# EAGLE schematic source_eagle (EAGLE 9.6.2)

## Sheet 1 of 2
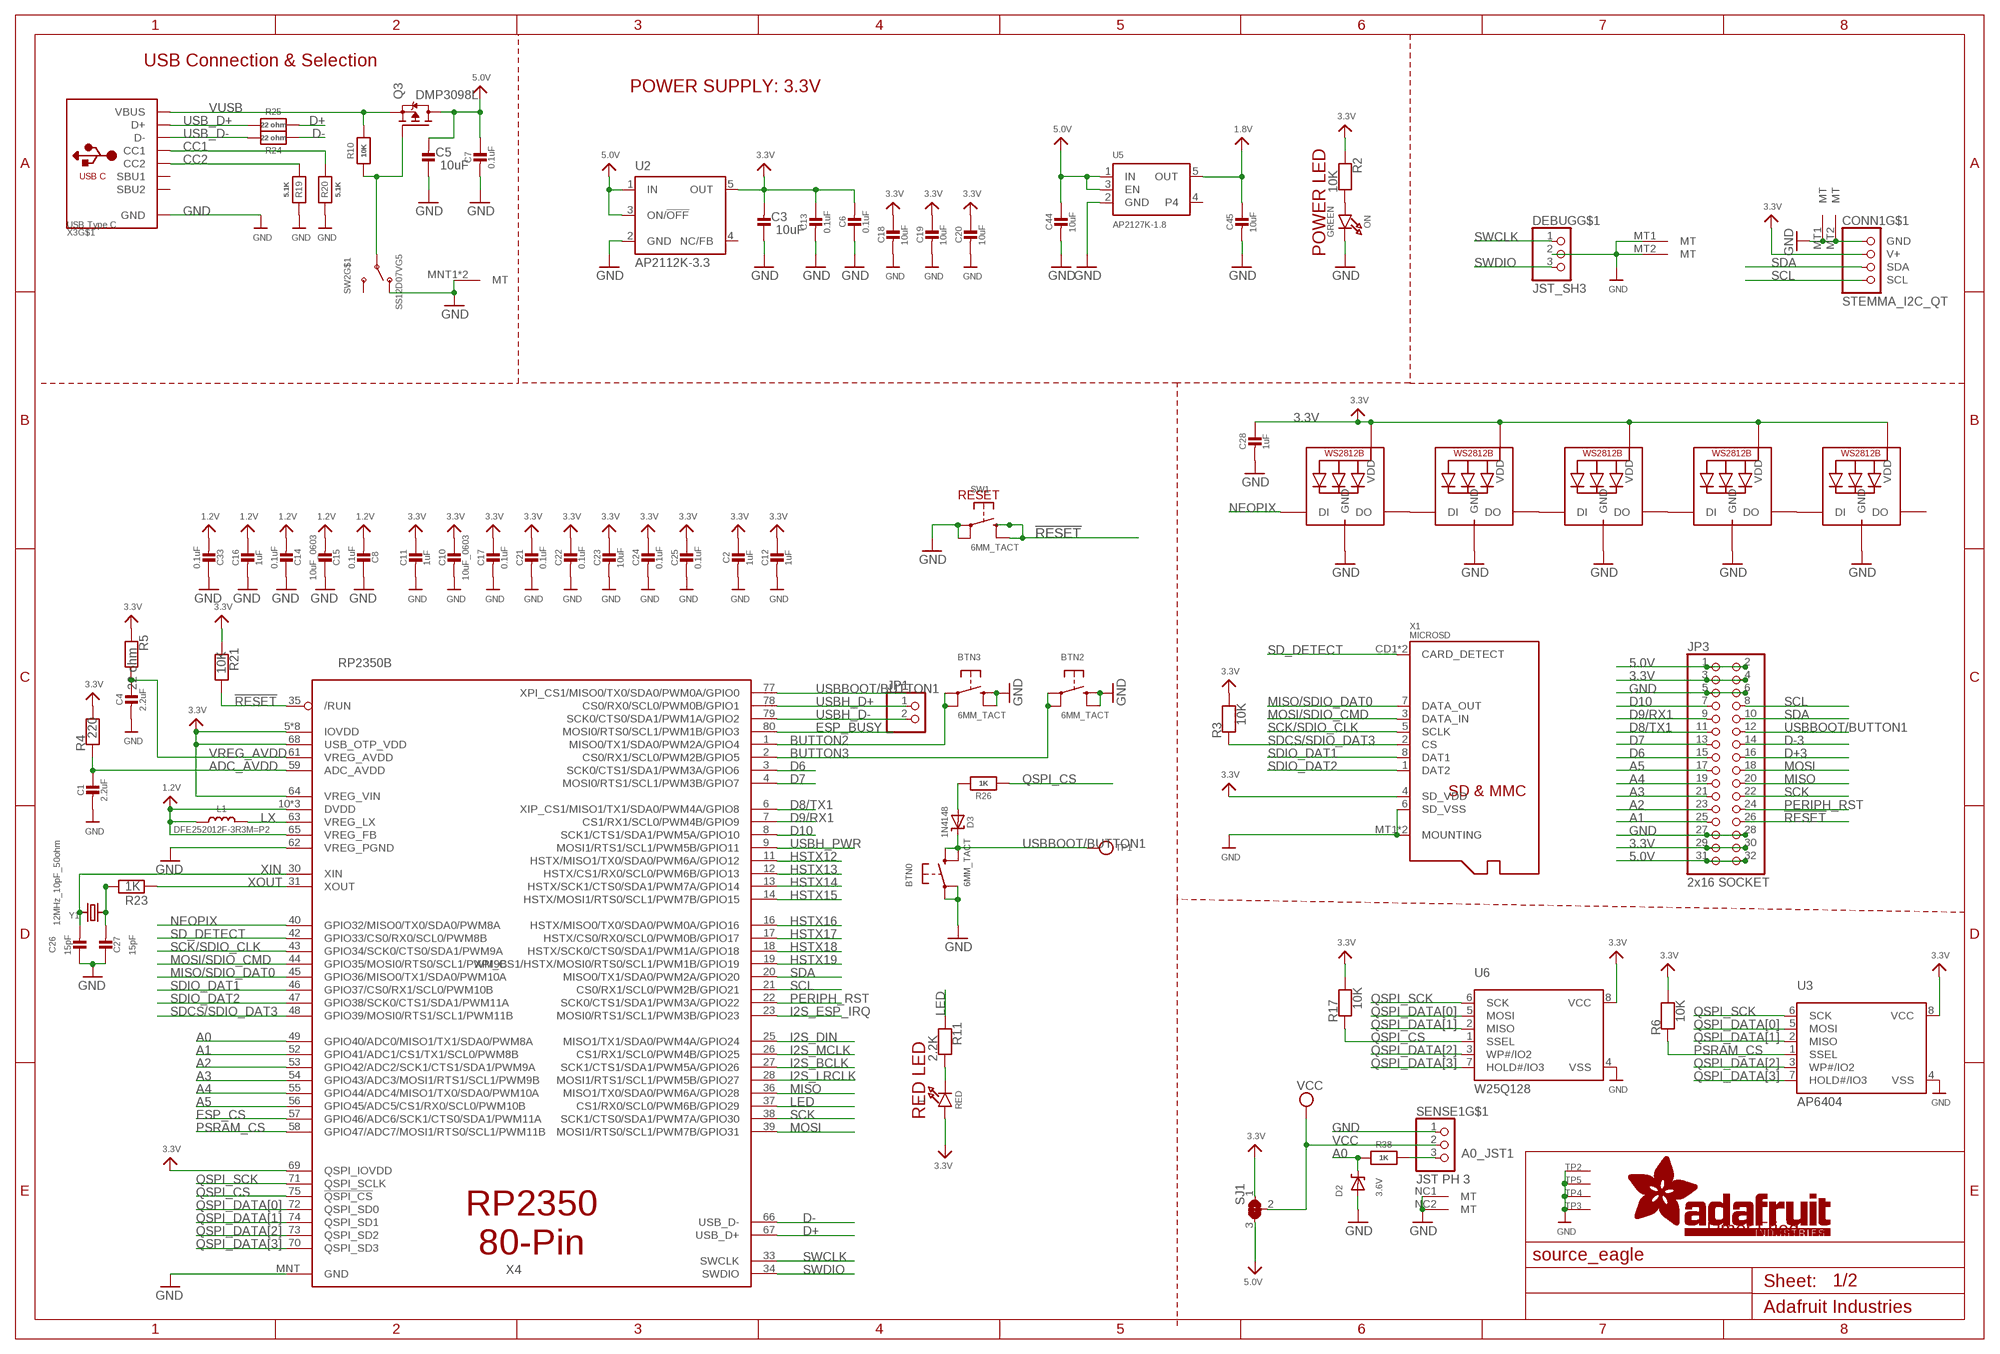
[diagram p0: schematic, sheet 1]

### Parts
BTN0  6MM_TACT  SWITCH_TACT_SMT  [EVQ-Q2]
BTN2  6MM_TACT  SWITCH_TACT_SMT  [EVQ-Q2]
BTN3  6MM_TACT  SWITCH_TACT_SMT  [EVQ-Q2]
C1  2.2uF  CAP_CERAMIC0603_NO  [0603-NO]
C2  1uF  CAP_CERAMIC0603_NO  [0603-NO]
C3  10uF  CAP_CERAMIC0805-NOOUTLINE  [0805-NO]
C4  2.2uF  CAP_CERAMIC0603_NO  [0603-NO]
C5  10uF  CAP_CERAMIC0805-NOOUTLINE  [0805-NO]
C6  0.1uF  CAP_CERAMIC0603_NO  [0603-NO]
C7  0.1uF  CAP_CERAMIC0603_NO  [0603-NO]
C8  0.1uF  CAP_CERAMIC0603_NO  [0603-NO]
C10  10uF_0603  CAP_CERAMIC_0603WIDE  [0603-NO_WIDE]
C11  1uF  CAP_CERAMIC0603_NO  [0603-NO]
C12  1uF  CAP_CERAMIC0603_NO  [0603-NO]
C13  0.1uF  CAP_CERAMIC0603_NO  [0603-NO]
C14  0.1uF  CAP_CERAMIC0603_NO  [0603-NO]
C15  10uF_0603  CAP_CERAMIC_0603WIDE  [0603-NO_WIDE]
C16  1uF  CAP_CERAMIC0603_NO  [0603-NO]
C17  0.1uF  CAP_CERAMIC0603_NO  [0603-NO]
C18  10uF  CAP_CERAMIC0805-NOOUTLINE  [0805-NO]
C19  10uF  CAP_CERAMIC0805-NOOUTLINE  [0805-NO]
C20  10uF  CAP_CERAMIC0805-NOOUTLINE  [0805-NO]
C21  0.1uF  CAP_CERAMIC0603_NO  [0603-NO]
C22  0.1uF  CAP_CERAMIC0603_NO  [0603-NO]
C23  10uF  CAP_CERAMIC0805-NOOUTLINE  [0805-NO]
C24  0.1uF  CAP_CERAMIC0603_NO  [0603-NO]
C25  0.1uF  CAP_CERAMIC0603_NO  [0603-NO]
C26  15pF  CAP_CERAMIC0603_NO  [0603-NO]
C27  15pF  CAP_CERAMIC0603_NO  [0603-NO]
C28  1uF  CAP_CERAMIC0603_NO  [0603-NO]
C33  0.1uF  CAP_CERAMIC0603_NO  [0603-NO]
C44  10uF  CAP_CERAMIC0805-NOOUTLINE  [0805-NO]
C45  10uF  CAP_CERAMIC0805-NOOUTLINE  [0805-NO]
CONN1  STEMMA_I2C_QT  [JST_SH4]
D2  3.6V  DIODE-ZENERSOD323  [SOD-323]
D3  1N4148  DIODE-SCHOTTKYSOD-323  [SOD-323]
DEBUG  JST_SH3  CON_JST_SH_3PINVERT  [JST_SH3_RA]
JP1  HEADER-1X2ROUND  [1X02_ROUND]
JP3  2x16 SOCKET  PINHD-2X16  [2X16]
L  RED  LED0603_NOOUTLINE  [CHIPLED_0603_NOOUTLINE]
L1  DFE252012F-3R3M=P2  INDUCTOR  [INDUCTOR_1007]
LED1  WS2812B_3535FULL  [LED3535_FULLPADS]
LED2  WS2812B_3535FULL  [LED3535_FULLPADS]
LED3  WS2812B_3535FULL  [LED3535_FULLPADS]
LED4  WS2812B_3535FULL  [LED3535_FULLPADS]
LED5  WS2812B_3535FULL  [LED3535_FULLPADS]
ON  GREEN  LED0603_NOOUTLINE  [CHIPLED_0603_NOOUTLINE]
Q3  DMP3098L  MOSFET-PWIDE  [SOT23-WIDE]
R2  10K  RESISTOR_0603_NOOUT  [0603-NO]
R3  10K  RESISTOR_0603_NOOUT  [0603-NO]
R4  220  RESISTOR_0603_NOOUT  [0603-NO]
R5  22 ohm  RESISTOR_0603_NOOUT  [0603-NO]
R6  10K  RESISTOR_0603_NOOUT  [0603-NO]
R10  10K  RESISTOR_0603_NOOUT  [0603-NO]
R11  2.2K  RESISTOR_0603_NOOUT  [0603-NO]
R17  10K  RESISTOR_0603_NOOUT  [0603-NO]
R19  5.1K  RESISTOR_0603_NOOUT  [0603-NO]
R20  5.1K  RESISTOR_0603_NOOUT  [0603-NO]
R21  10K  RESISTOR_0603_NOOUT  [0603-NO]
R23  1K  RESISTOR_0603_NOOUT  [0603-NO]
R24  22 ohm  RESISTOR_0603_NOOUT  [0603-NO]
R25  22 ohm  RESISTOR_0603_NOOUT  [0603-NO]
R26  1K  RESISTOR_0603_NOOUT  [0603-NO]
R38  1K  RESISTOR_0603_NOOUT  [0603-NO]
SENSE1  JST PH 3  CON_JST_PH_3PIN  [JSTPH3]
SJ1  SOLDERJUMPER_2WAY  [SOLDERJUMPER_2WAY_OPEN_NOPASTE]
SW1  6MM_TACT  SWITCH_TACT_SMT  [EVQ-Q2]
SW2  SS12D07VG5  SWITCH_SPDTSS12D07VG5  [SPDT_SS12D07VG5]
TP1  TESTPOINTROUND1.5MMNO  [TESTPOINT_ROUND_1.5MM_NO]
TP2  DNP  SEWTAP_SMTNUTM3  [SMT_NUT_3MM]
TP3  SEWTAP_SMTNUTM3  [SMT_NUT_3MM]
TP4  SEWTAP_SMTNUTM3  [SMT_NUT_3MM]
TP5  SEWTAP_SMTNUTM3  [SMT_NUT_3MM]
U2  AP2112K-3.3  LP2985-XXDBVR33  [SOT23-DBV]
U3  AP6404  SPIFLASH_8PIN208MIL  [SOIC8_208MIL]
U5  AP2127K-1.8  VREG_SOT23-5  [SOT23-5]
U6  W25Q128  SPIFLASH_8PIN208MIL  [SOIC8_208MIL]
X1  MICROSD  [MICROSD]
X3  USB Type C  USB_C  [USB_C_CUSB31-CFM2AX-01-X]
X4  RP2350B  [QFN80]
Y1  12MHz_10pF_50ohm  CRYSTAL2.5X2.0  [CRYSTAL_2.5X2]

### Nets
1.2V: C8.2 C14.2 C15.2 C16.1 C33.2 L1.P$1 X4.10(DVDD) X4.32(DVDD) X4.51(DVDD) X4.65(VREG_FB)
1.8V: C45.1 U5.5(OUT) ; also sheet 2
3.3V [Power]: C2.1 C3.2 C6.2 C10.1 C11.1 C12.1 C13.1 C17.1 C18.1 C19.1 C20.1 C21.1 C22.1 C23.1 C24.1 C25.1 C28.1 CONN1.2(V+) JP3.3 JP3.4 JP3.29 JP3.30 L.A LED1.2(VDD) LED2.2(VDD) LED3.2(VDD) LED4.2(VDD) LED5.2(VDD) R2.1 R3.2 R4.2 R5.1 R6.2 R17.2 R21.1 SJ1.1 U2.5(OUT) U3.8(VCC) U6.8(VCC) X1.4(SD_VDD) X4.5(IOVDD) X4.15(IOVDD) X4.24(IOVDD) X4.29(IOVDD) X4.41(IOVDD) X4.50(IOVDD) X4.60(IOVDD) X4.64(VREG_VIN) X4.68(USB_OTP_VDD) X4.69(QSPI_IOVDD) X4.76(IOVDD) ; also sheet 2
5.0V [Power]: C5.2 C7.1 C44.1 JP3.1 JP3.2 JP3.31 JP3.32 Q3.3(D) SJ1.3 U2.1(IN) U2.3(ON/!OFF) U5.1(IN) U5.3(EN) ; also sheet 2
!RESET: JP3.26 R21.2 SW1.B'(S1) SW1.B(S) X4.35(/RUN)
A0: D2.C R38.2 X4.49(GPIO40/ADC0/MISO1/TX1/SDA0/PWM8A)
A0_JST1: R38.1 SENSE1.3
A1: JP3.25 X4.52(GPIO41/ADC1/CS1/TX1/SCL0/PWM8B)
A2: JP3.23 X4.53(GPIO42/ADC2/SCK1/CTS1/SDA1/PWM9A)
A3: JP3.21 X4.54(GPIO43/ADC3/MOSI1/RTS1/SCL1/PWM9B)
A4: JP3.19 X4.55(GPIO44/ADC4/MISO1/TX0/SDA0/PWM10A)
A5: JP3.17 X4.56(GPIO45/ADC5/CS1/RX0/SCL0/PWM10B)
ADC_AVDD: C1.1 R4.1 X4.59(ADC_AVDD)
BUTTON2: BTN3.A'(P1) BTN3.A(P) X4.1(MISO0/TX1/SDA0/PWM2A/GPIO4)
BUTTON3: BTN2.A'(P1) BTN2.A(P) X4.2(CS0/RX1/SCL0/PWM2B/GPIO5)
CC1: R20.2 X3.A5(CC1)
CC2: R19.2 X3.B5(CC2)
D6: JP3.15 X4.3(SCK0/CTS1/SDA1/PWM3A/GPIO6)
D7: JP3.13 X4.4(MOSI0/RTS1/SCL1/PWM3B/GPIO7)
D8/TX1: JP3.11 X4.6(XIP_CS1/MISO1/TX1/SDA0/PWM4A/GPIO8) ; also sheet 2
D9/RX1: JP3.9 X4.7(CS1/RX1/SCL0/PWM4B/GPIO9) ; also sheet 2
D10: JP3.7 X4.8(SCK1/CTS1/SDA1/PWM5A/GPIO10)
D+: R25.2 X4.67(USB_D+)
D+3: JP3.16 ; also sheet 2
D-: R24.2 X4.66(USB_D-)
D-3: JP3.14 ; also sheet 2
ESP_BUSY: X4.80(MOSI0/RTS0/SCL1/PWM1B/GPIO3) ; also sheet 2
ESP_CS: X4.57(GPIO46/ADC6/SCK1/CTS0/SDA1/PWM11A) ; also sheet 2
GND [Power]: BTN0.A'(P1) BTN0.A(P) BTN2.B'(S1) BTN2.B(S) BTN3.B'(S1) BTN3.B(S) C1.2 C2.2 C3.1 C4.2 C5.1 C6.1 C7.2 C8.1 C10.2 C11.2 C12.2 C13.2 C14.1 C15.1 C16.2 C17.2 C18.2 C19.2 C20.2 C21.2 C22.2 C23.2 C24.2 C25.2 C26.1 C27.1 C28.2 C33.1 C44.2 C45.2 CONN1.1(GND) CONN1.MT1(MT) CONN1.MT2(MT) D2.A DEBUG.2 DEBUG.MT1(MT) DEBUG.MT2(MT) JP3.5 JP3.6 JP3.27 JP3.28 LED1.4(GND) LED2.4(GND) LED3.4(GND) LED4.4(GND) LED5.4(GND) ON.C R19.1 R20.1 SENSE1.1 SENSE1.NC1(MT) SENSE1.NC2(MT) SW1.A'(P1) SW1.A(P) SW2.MNT1(MT) SW2.MNT2(MT) SW2.T1(O) TP2.P$1(SEW) TP3.P$1(SEW) TP4.P$1(SEW) TP5.P$1(SEW) U2.2(GND) U3.4(VSS) U5.2(GND) U6.4(VSS) X1.6(SD_VSS) X1.MT1(MOUNTING) X1.MT2(MOUNTING) X3.A1B12(GND) X3.B1A12(GND) X4.62(VREG_PGND) X4.MNT(GND) ; also sheet 2
HSTX12: X4.11(HSTX/MISO1/TX0/SDA0/PWM6A/GPIO12) ; also sheet 2
HSTX13: X4.12(HSTX/CS1/RX0/SCL0/PWM6B/GPIO13) ; also sheet 2
HSTX14: X4.13(HSTX/SCK1/CTS0/SDA1/PWM7A/GPIO14) ; also sheet 2
HSTX15: X4.14(HSTX/MOSI1/RTS0/SCL1/PWM7B/GPIO15) ; also sheet 2
HSTX16: X4.16(HSTX/MISO0/TX0/SDA0/PWM0A/GPIO16) ; also sheet 2
HSTX17: X4.17(HSTX/CS0/RX0/SCL0/PWM0B/GPIO17) ; also sheet 2
HSTX18: X4.18(HSTX/SCK0/CTS0/SDA1/PWM1A/GPIO18) ; also sheet 2
HSTX19: X4.19(XPI_CS1/HSTX/MOSI0/RTS0/SCL1/PWM1B/GPIO19) ; also sheet 2
I2S_BCLK: X4.27(SCK1/CTS1/SDA1/PWM5A/GPIO26) ; also sheet 2
I2S_DIN: X4.25(MISO1/TX1/SDA0/PWM4A/GPIO24) ; also sheet 2
I2S_ESP_IRQ: X4.23(MOSI0/RTS1/SCL1/PWM3B/GPIO23) ; also sheet 2
I2S_LRCLK: X4.28(MOSI1/RTS1/SCL1/PWM5B/GPIO27) ; also sheet 2
I2S_MCLK: X4.26(CS1/RX1/SCL0/PWM4B/GPIO25) ; also sheet 2
LED: R11.1 X4.37(CS1/RX0/SCL0/PWM6B/GPIO29) ; also sheet 2
LX: L1.P$2 X4.63(VREG_LX)
MISO: JP3.20 X4.36(MISO1/TX0/SDA0/PWM6A/GPIO28) ; also sheet 2
MISO/SDIO_DAT0: X1.7(DATA_OUT) X4.45(GPIO36/MISO0/TX1/SDA0/PWM10A)
MOSI: JP3.18 X4.39(MOSI1/RTS0/SCL1/PWM7B/GPIO31) ; also sheet 2
MOSI/SDIO_CMD: X1.3(DATA_IN) X4.44(GPIO35/MOSI0/RTS0/SCL1/PWM9B)
N$1: L.C R11.2
N$2: ON.A R2.2
N$3: LED1.1(DI) LED2.3(DO)
N$6: D3.A R26.2
N$9: LED1.3(DO) LED3.1(DI)
N$10: C27.2 R23.1 Y1.3
N$11: LED3.3(DO) LED4.1(DI)
N$15: LED4.3(DO) LED5.1(DI)
NEOPIX: LED2.1(DI) X4.40(GPIO32/MISO0/TX0/SDA0/PWM8A)
PERIPH_RST: JP3.24 X4.22(SCK0/CTS1/SDA1/PWM3A/GPIO22) ; also sheet 2
PSRAM_CS: R6.1 U3.1(SSEL) X4.58(GPIO47/ADC7/MOSI1/RTS0/SCL1/PWM11B)
PWR_SWITCH: Q3.1(G) R10.1 SW2.P
QSPI_CS: R17.1 R26.1 U6.1(SSEL) X4.75(!QSPI_CS)
QSPI_DATA[0]: U3.5(MOSI) U6.5(MOSI) X4.72(QSPI_SD0)
QSPI_DATA[1]: U3.2(MISO) U6.2(MISO) X4.74(QSPI_SD1)
QSPI_DATA[2]: U3.3(WP#/IO2) U6.3(WP#/IO2) X4.73(QSPI_SD2)
QSPI_DATA[3]: U3.7(HOLD#/IO3) U6.7(HOLD#/IO3) X4.70(QSPI_SD3)
QSPI_SCK: U3.6(SCK) U6.6(SCK) X4.71(QSPI_SCLK)
SCK: JP3.22 X4.38(SCK1/CTS0/SDA1/PWM7A/GPIO30) ; also sheet 2
SCK/SDIO_CLK: X1.5(SCLK) X4.43(GPIO34/SCK0/CTS0/SDA1/PWM9A)
SCL: CONN1.4(SCL) JP3.8 X4.21(CS0/RX1/SCL0/PWM2B/GPIO21) ; also sheet 2
SD_DETECT: X1.CD1(CARD_DETECT) X1.CD2(CARD_DETECT) X4.42(GPIO33/CS0/RX0/SCL0/PWM8B)
SDA: CONN1.3(SDA) JP3.10 X4.20(MISO0/TX1/SDA0/PWM2A/GPIO20) ; also sheet 2
SDCS/SDIO_DAT3: R3.1 X1.2(CS) X4.48(GPIO39/MOSI0/RTS1/SCL1/PWM11B)
SDIO_DAT1: X1.8(DAT1) X4.46(GPIO37/CS0/RX1/SCL0/PWM10B)
SDIO_DAT2: X1.1(DAT2) X4.47(GPIO38/SCK0/CTS1/SDA1/PWM11A)
SWCLK: DEBUG.1 X4.33(SWCLK)
SWDIO: DEBUG.3 X4.34(SWDIO)
USB_D+: R25.1 X3.A6(D+) X3.B6(D+)
USB_D-: R24.1 X3.A7(D-) X3.B7(D-)
USBBOOT/BUTTON1: BTN0.B'(S1) BTN0.B(S) D3.C JP3.12 TP1.P$1 X4.77(XPI_CS1/MISO0/TX0/SDA0/PWM0A/GPIO0)
USBH_D+: JP1.1 X4.78(CS0/RX0/SCL0/PWM0B/GPIO1) ; also sheet 2
USBH_D-: JP1.2 X4.79(SCK0/CTS0/SDA1/PWM1A/GPIO2) ; also sheet 2
USBH_PWR: X4.9(MOSI1/RTS1/SCL1/PWM5B/GPIO11) ; also sheet 2
VCC: SENSE1.2 SJ1.2
VREG_AVDD: C4.1 R5.2 X4.61(VREG_AVDD)
VUSB: Q3.2(S) R10.2 X3.A4B9(VBUS) X3.B4A9(VBUS)
XIN: C26.2 X4.30(XIN) Y1.1
XOUT: R23.2 X4.31(XOUT)
Unconnected: LED5.3(DO) SW2.T2(S) U2.4(NC/FB) U5.4 X3.A8(SBU1) X3.B8(SBU2) X3.M1(MT) X3.M2(MT) X3.M3(MT) X3.M4(MT)

### Notes on the sheet
- USB Connection & Selection
- POWER SUPPLY: 3.3V
- POWER LED
- RESET
- RED LED
- Limor Fried

## Sheet 2 of 2
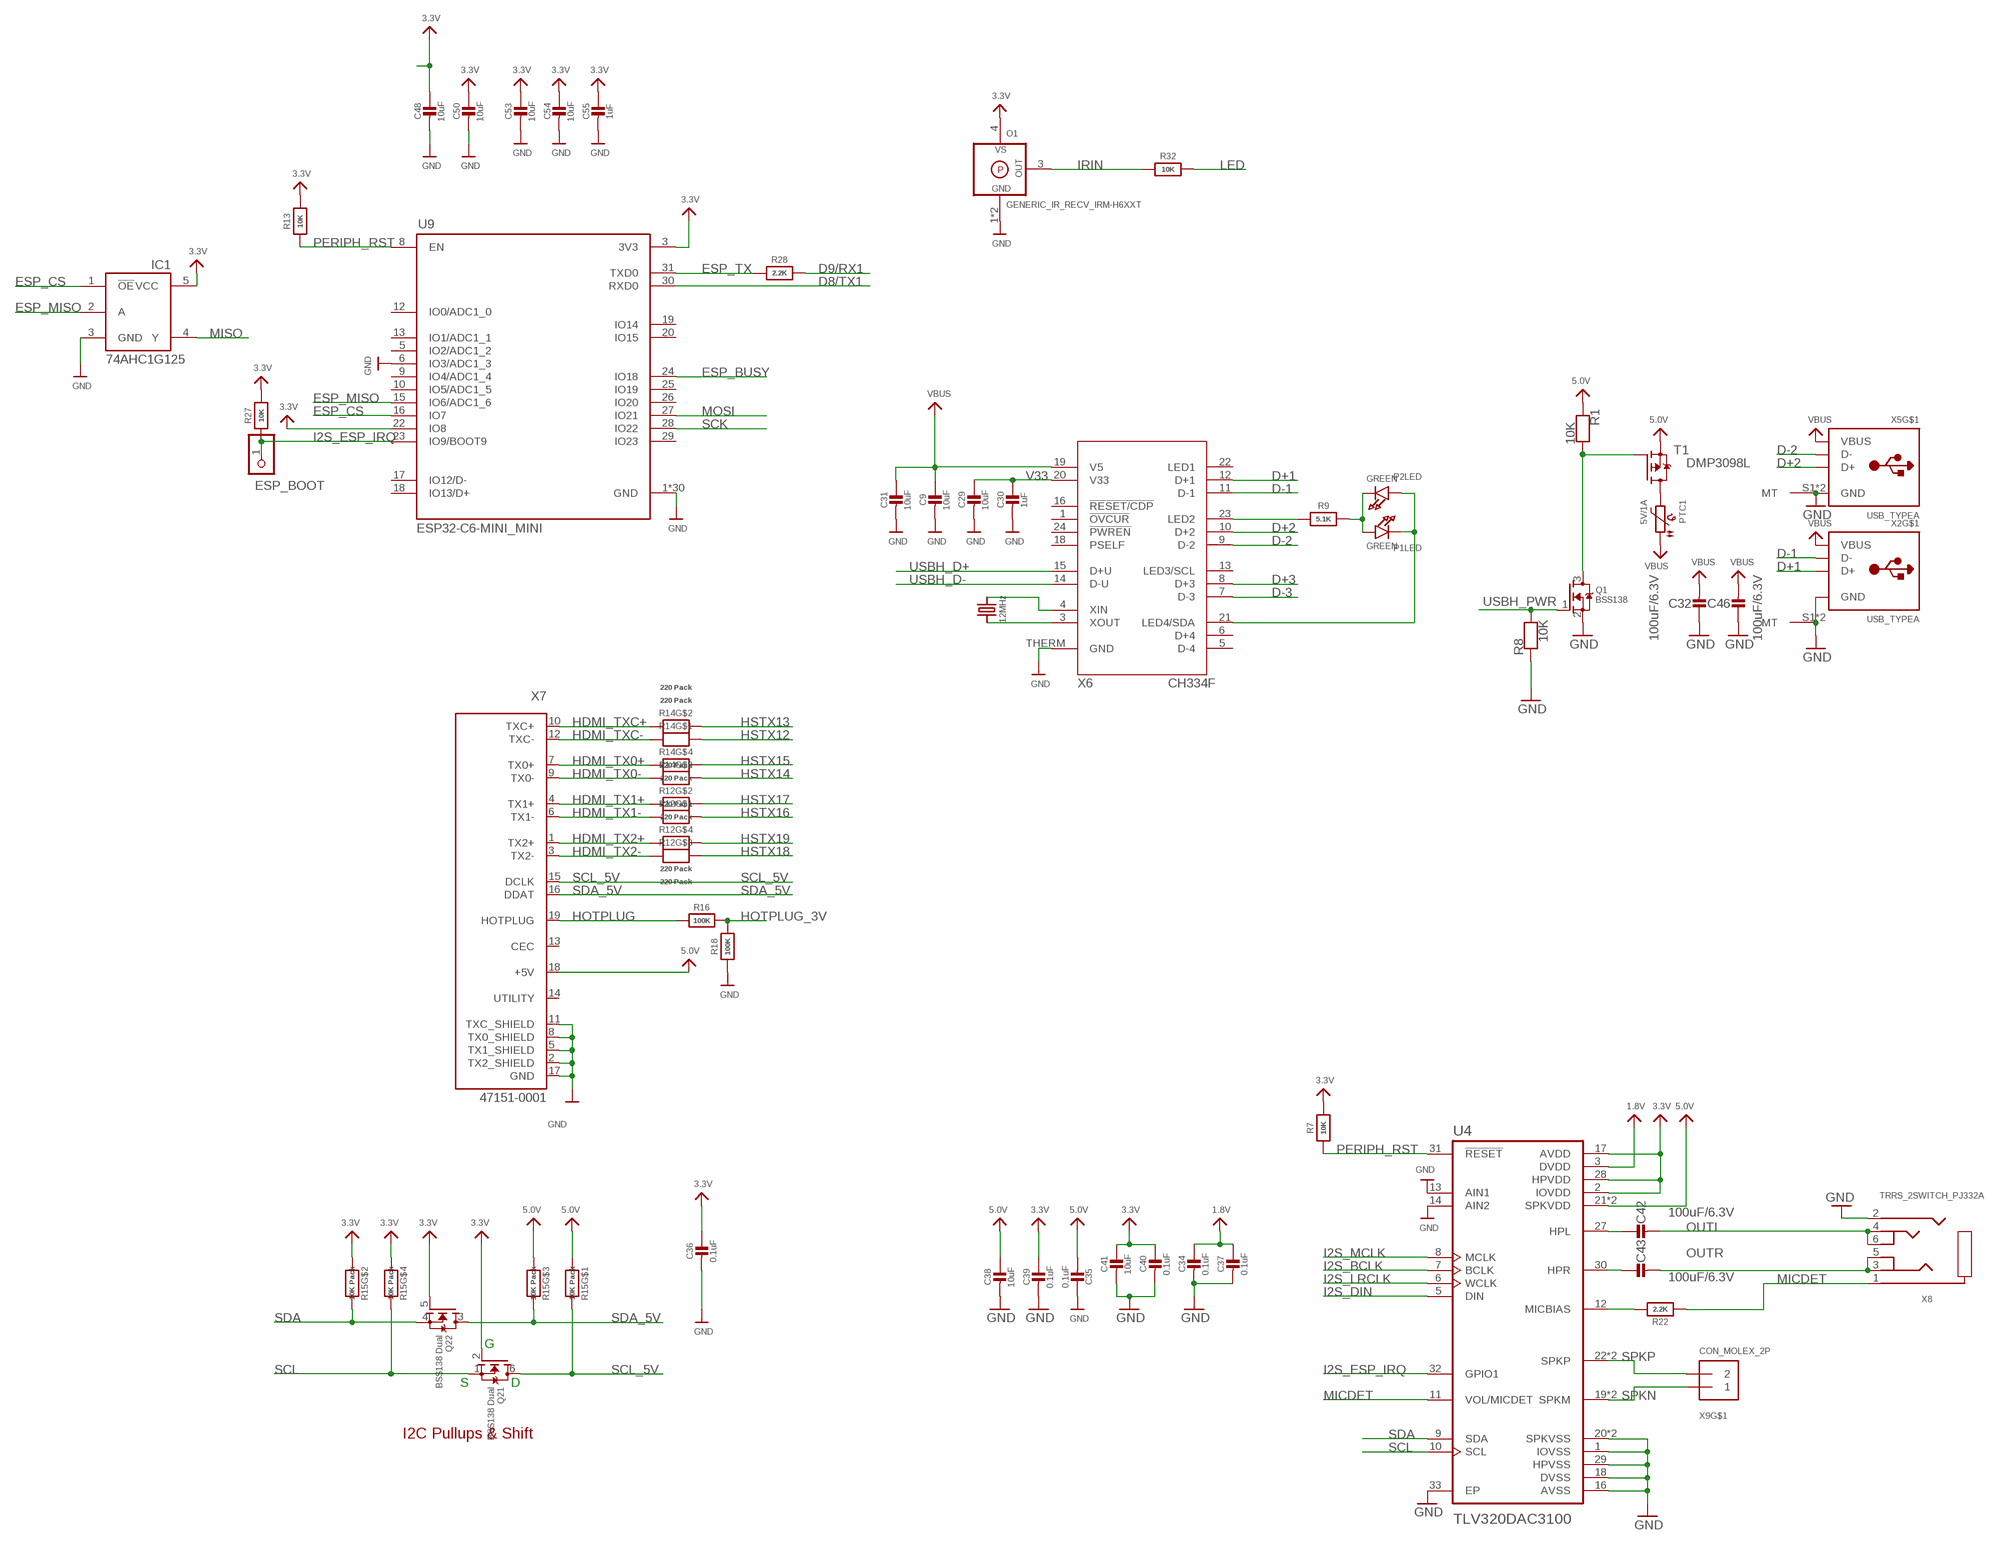
[diagram p1: schematic, sheet 2]

### Parts
C9  10uF  CAP_CERAMIC0805-NOOUTLINE  [0805-NO]
C29  10uF  CAP_CERAMIC0805-NOOUTLINE  [0805-NO]
C30  1uF  CAP_CERAMIC0603_NO  [0603-NO]
C31  10uF  CAP_CERAMIC0805-NOOUTLINE  [0805-NO]
C32  100uF/6.3V  CAP_CERAMIC_1206  [_1206]
C34  0.1uF  CAP_CERAMIC0603_NO  [0603-NO]
C35  0.1uF  CAP_CERAMIC0603_NO  [0603-NO]
C36  0.1uF  CAP_CERAMIC0603_NO  [0603-NO]
C37  0.1uF  CAP_CERAMIC0603_NO  [0603-NO]
C38  10uF  CAP_CERAMIC0805-NOOUTLINE  [0805-NO]
C39  0.1uF  CAP_CERAMIC0603_NO  [0603-NO]
C40  0.1uF  CAP_CERAMIC0603_NO  [0603-NO]
C41  10uF  CAP_CERAMIC0805-NOOUTLINE  [0805-NO]
C42  100uF/6.3V  CAP_CERAMIC_1206  [_1206]
C43  100uF/6.3V  CAP_CERAMIC_1206  [_1206]
C46  100uF/6.3V  CAP_CERAMIC_1206  [_1206]
C48  10uF  CAP_CERAMIC0805-NOOUTLINE  [0805-NO]
C50  10uF  CAP_CERAMIC0805-NOOUTLINE  [0805-NO]
C53  10uF  CAP_CERAMIC0805-NOOUTLINE  [0805-NO]
C54  10uF  CAP_CERAMIC0805-NOOUTLINE  [0805-NO]
C55  1uF  CAP_CERAMIC0603_NO  [0603-NO]
ESP_BOOT  HEADER-1X1ROUND  [1X01_ROUND]
IC1  74AHC1G125  [SOT23-5L]
O1  GENERIC_IR_RECV_IRM-H6XXT  [IRM-H6XXT]
P1LED  GREEN  LED0603_NOOUTLINE  [CHIPLED_0603_NOOUTLINE]
P2LED  GREEN  LED0603_NOOUTLINE  [CHIPLED_0603_NOOUTLINE]
PTC1  5V/1A  PTC_0805  [0805-NO]
Q1  BSS138  MOSFET-NWIDE  [SOT23-WIDE]
Q2  BSS138 Dual  MOSFET-N_DUAL  [SOT363]
R1  10K  RESISTOR_0603_NOOUT  [0603-NO]
R7  10K  RESISTOR_0603_NOOUT  [0603-NO]
R8  10K  RESISTOR_0603_NOOUT  [0603-NO]
R9  5.1K  RESISTOR_0603_NOOUT  [0603-NO]
R12  220 Pack  RESISTOR_4PACK  [RESPACK_4X0603]
R13  10K  RESISTOR_0603_NOOUT  [0603-NO]
R14  220 Pack  RESISTOR_4PACK  [RESPACK_4X0603]
R15  10K Pack  RESISTOR_4PACK  [RESPACK_4X0603]
R16  100K  RESISTOR_0603_NOOUT  [0603-NO]
R18  100K  RESISTOR_0603_NOOUT  [0603-NO]
R22  2.2K  RESISTOR_0603_NOOUT  [0603-NO]
R27  10K  RESISTOR_0603_NOOUT  [0603-NO]
R28  2.2K  RESISTOR_0603_NOOUT  [0603-NO]
R32  10K  RESISTOR_0603_NOOUT  [0603-NO]
T1  DMP3098L  MOSFET-PWIDE  [SOT23-WIDE]
U4  TLV320DAC3100  [TLV320DAC3100]
U9  ESP32-C6-MINI_MINI  [ESP32-PICO-MINI]
X2  USB_TYPEA  USB_TYPEA_THMSHORT  [USB_TYPE_A_THM_SHORT]
X5  USB_TYPEA  USB_TYPEA_THMSHORT  [USB_TYPE_A_THM_SHORT]
X6  CH334F  [QFN24_4MM]
X7  47151-0001  HDMI_MOLEX_47151  [HDMI_MOLEX_47151-0001]
X8  TRRS_2SWITCH_PJ332A  [PJ-332A]
X9  CON_MOLEX_2P  [53398-0271]
Y2  12MHz  CRYSTAL2.5X2.0  [CRYSTAL_2.5X2]

### Nets
1.8V: C34.1 C37.1 U4.3(DVDD) ; also sheet 1
3.3V [Power]: C36.1 C39.1 C40.1 C41.1 C48.1 C50.1 C53.1 C54.1 C55.1 IC1.5(VCC) O1.4(VS) Q2.2(1:G) Q2.5(2:G) R7.2 R13.2 R15.5 R15.7 R27.2 U4.2(IOVDD) U4.17(AVDD) U4.28(HPVDD) U9.3(3V3) U9.22(IO8) ; also sheet 1
5.0V [Power]: C35.2 C38.1 R1.1 R15.6 R15.8 T1.2(S) U4.21(SPKVDD) U4.24(SPKVDD) X7.18(+5V) ; also sheet 1
D8/TX1: U9.30(RXD0) ; also sheet 1
D9/RX1: R28.1 ; also sheet 1
D+1: X2.D+ X6.12(D+1)
D+2: X5.D+ X6.10(D+2)
D+3: X6.8(D+3) ; also sheet 1
D-1: X2.D- X6.11(D-1)
D-2: X5.D- X6.9(D-2)
D-3: X6.7(D-3) ; also sheet 1
ESP_BUSY: U9.24(IO18) ; also sheet 1
ESP_CS: IC1.1(!OE) U9.16(IO7) ; also sheet 1
ESP_MISO: IC1.2(A) U9.15(IO6/ADC1_6)
ESP_TX: R28.2 U9.31(TXD0)
GND [Power]: C9.2 C29.2 C30.2 C31.2 C32.1 C34.2 C35.1 C36.2 C37.2 C38.2 C39.2 C40.2 C41.2 C46.1 C48.2 C50.2 C53.2 C54.2 C55.2 IC1.3(GND) O1.1(GND) O1.2(GND) Q1.2(S) R8.1 R18.1 U4.1(IOVSS) U4.13(AIN1) U4.14(AIN2) U4.16(AVSS) U4.18(DVSS) U4.20(SPKVSS) U4.25(SPKVSS) U4.29(HPVSS) U4.33(EP) U9.1(GND) U9.2(GND) U9.6(IO3/ADC1_3) U9.11(GND) U9.14(GND) U9.36(GND) U9.37(GND) U9.38(GND) U9.39(GND) U9.40(GND) U9.41(GND) U9.42(GND) U9.43(GND) U9.44(GND) U9.45(GND) U9.46(GND) U9.47(GND) U9.48(GND) U9.49(GND) U9.50(GND) U9.51(GND) U9.52(GND) U9.53(GND) U9.54(GND) U9.55(GND) U9.56(GND) U9.57(GND) U9.58(GND) U9.59(GND) U9.60(GND) U9.61(GND) X2.GND X2.S1(MT) X2.S2(MT) X5.GND X5.S1(MT) X5.S2(MT) X6.THERM(GND) X7.2(TX2_SHIELD) X7.5(TX1_SHIELD) X7.8(TX0_SHIELD) X7.11(TXC_SHIELD) X7.17(GND) X8.2(RING1) ; also sheet 1
HDMI_TX0+: R14.4 X7.7(TX0+)
HDMI_TX0-: R14.3 X7.9(TX0-)
HDMI_TX1+: R12.2 X7.4(TX1+)
HDMI_TX1-: R12.1 X7.6(TX1-)
HDMI_TX2+: R12.4 X7.1(TX2+)
HDMI_TX2-: R12.3 X7.3(TX2-)
HDMI_TXC+: R14.2 X7.10(TXC+)
HDMI_TXC-: R14.1 X7.12(TXC-)
HOTPLUG: R16.1 X7.19(HOTPLUG)
HOTPLUG_3V: R16.2 R18.2
HSTX12: R14.8 ; also sheet 1
HSTX13: R14.7 ; also sheet 1
HSTX14: R14.6 ; also sheet 1
HSTX15: R14.5 ; also sheet 1
HSTX16: R12.8 ; also sheet 1
HSTX17: R12.7 ; also sheet 1
HSTX18: R12.6 ; also sheet 1
HSTX19: R12.5 ; also sheet 1
I2S_BCLK: U4.7(BCLK) ; also sheet 1
I2S_DIN: U4.5(DIN) ; also sheet 1
I2S_ESP_IRQ: ESP_BOOT.1 R27.1 U4.32(GPIO1) U9.23(IO9/BOOT9) ; also sheet 1
I2S_LRCLK: U4.6(WCLK) ; also sheet 1
I2S_MCLK: U4.8(MCLK) ; also sheet 1
IRIN: O1.3(OUT) R32.2
LED: R32.1 ; also sheet 1
MICDET: R22.1 U4.11(VOL/MICDET) X8.1(RING)
MISO: IC1.4(Y) ; also sheet 1
MOSI: U9.27(IO21) ; also sheet 1
N$4: PTC1.2 T1.3(D)
N$5: Q1.3(D) R1.2 T1.1(G)
N$7: X6.3(XOUT) Y2.1
N$8: X6.4(XIN) Y2.3
N$12: P1LED.A P2LED.C R9.2
N$13: R9.1 X6.23(LED2)
N$14: P1LED.C P2LED.A X6.21(LED4/SDA)
N$16: C43.1 U4.30(HPR)
N$17: C42.1 U4.27(HPL)
N$18: R22.2 U4.12(MICBIAS)
OUTL: C42.2 X8.4(TIP) X8.6(TIP_SW)
OUTR: C43.2 X8.3(RING2) X8.5(R2_SW)
PERIPH_RST: R7.1 R13.1 U4.31(!RESET) U9.8(EN) ; also sheet 1
SCK: U9.28(IO22) ; also sheet 1
SCL: Q2.1(1:S) R15.4 U4.10(SCL) ; also sheet 1
SCL_5V: Q2.6(1:D) R15.1 X7.15(DCLK)
SDA: Q2.4(2:S) R15.2 U4.9(SDA) ; also sheet 1
SDA_5V: Q2.3(2:D) R15.3 X7.16(DDAT)
SPKN: U4.19(SPKM) U4.23(SPKM) X9.1
SPKP: U4.22(SPKP) U4.26(SPKP) X9.2
USBH_D+: X6.15(D+U) ; also sheet 1
USBH_D-: X6.14(D-U) ; also sheet 1
USBH_PWR: Q1.1(G) R8.2 ; also sheet 1
V33 [Power]: C29.1 C30.1 X6.20(V33)
VBUS: C9.1 C31.1 C32.2 C46.2 PTC1.1 X2.VBUS X5.VBUS X6.19(V5)
Unconnected: U9.5(IO2/ADC1_2) U9.9(IO4/ADC1_4) U9.10(IO5/ADC1_5) U9.12(IO0/ADC1_0) U9.13(IO1/ADC1_1) U9.17(IO12/D-) U9.18(IO13/D+) U9.19(IO14) U9.20(IO15) U9.25(IO19) U9.26(IO20) U9.29(IO23) X6.1(!OVCUR) X6.5(D-4) X6.6(D+4) X6.13(LED3/SCL) X6.16(!RESET/CDP) X6.18(PSELF) X6.22(LED1) X6.24(!PWREN) X7.13(CEC) X7.14(UTILITY) X9.M1(MT) X9.M2(MT)

### Notes on the sheet
- G
- S | D
- I2C Pullups & Shift

## Power pins joined to a net without a drawn wire
GND: X7.P$1(GND) X7.P$2(GND) X7.P$3(GND) X7.P$4(GND)

## Library data of the parts
BTN0 BTN2 BTN3 SW1 = adafruit_electromech:SWITCH_TACT_SMT: SMT Tact Switches RKB2 https://www.digikey.com/short/m027prz5
C1-C46 C50 C53-C55 = microbuilder:CAP_CERAMIC: Ceramic Capacitors For new designs, use the packages preceded by an '_' character since they are more reliable: The following footprints should be used on most boards: _0402 - Standard footprint for regular board layouts _0603 - Standard footprint for regular board layouts _0805 - Standard footprint for regular board layouts _1206 - Standard footprint for regular board layouts For extremely tight-pitch boards where space is at a premium, the following 'micro-pitch' footprints can be used (smaller pads, no silkscreen outline, etc.): _0402MP - Micro-pitch footprint for very dense/compact boards _0603MP - Micro-pitch footprint for very dense/compact boards _0805MP - Micro-pitch footprint for very dense/compact boards _1206MP - Micro-pitch footprint for very dense/compact boards
C48 = microbuilder:CAP_CERAMIC: Ceramic Capacitors For new designs, use the packages preceded by an '_' character since they are more reliable: The following footprints should be used on most boards: _0402 - Standard footprint for regular board layouts _0603 - Standard footprint for regular board layouts _0805 - Standard footprint for regular board layouts _1206 - Standard footprint for regular board layouts For extremely tight-pitch boards where space is at a premium, the following 'micro-pitch' footprints can be used (smaller pads, no silkscreen outline, etc.): _0402MP - Micro-pitch footprint for very dense/compact boards _0603MP - Micro-pitch footprint for very dense/compact boards _0805MP - Micro-pitch footprint for very dense/compact boards _1206MP - Micro-pitch footprint for very dense/compact boards; REV: C
CONN1 = adafruit_electromech:STEMMA_I2C; LCSC: C2845363
D2 = microbuilder:DIODE-ZENER: Zener Diode SMA: 30V 1W Zener Diode, 1.2Vf - Digikey: SMAZ30-FDICT-ND
D3 = microbuilder:DIODE-SCHOTTKY
DEBUG = adafruit_electromech:CON_JST_SH_3PIN
ESP_BOOT = microbuilder:HEADER-1X1: PIN HEADER
IC1 = adafruit:74AHC1G125
JP1 = microbuilder:HEADER-1X2: PIN HEADER
JP3 = pinhead:PINHD-2X16: PIN HEADER
L ON P1LED P2LED = microbuilder:LED: LED 0603 - 0603 Surface Mount Package 2mA: Green LED - Low Power (3.9mcd, 2ma, 1.7Vf) - Digikey: 475-2709-2-ND Orange LED - Low Power (9.8mcd, 2ma, 1.8Vf) - Digikey: 475-1194-2-ND Red LED - Low Power (5mcd, 2ma, 1.8Vf) - Digikey: 475-1195-2-ND Yellow LED - Low Power (7mcd, 2ma, 1.8Vf) - Digikey: 475-1196-2-ND 5mA: Blue LED - Low Power (17mcd, 5ma, 2.9Vf) - Digikey: LNJ937W8CRACT-ND 0805 - 0805 Surface Mount Package 2mA: Red LED (8.8mcd, 2mA, 1.8Vf, Clear) - Low Power [Digikey: 475-2510-1-ND] Green LED (5mcd, 2mA, 1.8Vf, Clear) - Low Power [Digikey: 475-2730-1-ND] Yellow LED (11.3mcd, 2mA, 1.8Vf, Clear) - Low Power [Digikey: 475-2555-1-ND] 20mA: Red LED (104mcd, 20mA, Diffused) - LS R976 [Digikey: 475-1278-6-ND] Red LED (12mcd, 20mA, 2.0Vf, Clear) - APT2012EC [Digikey: 754-1128-1-ND] Green LED (15mcd, 20mA, 2.2Vf, Clear) - APT2012GC [Digikey: 754-1131-1-ND] Orange LED (160mcd, 20mA, 2.1Vf, Clear) - APT2012SECK [Digikey: 754-1130-1-ND] 1206 - 1206 Surface Mount Package Green LED (26mcd, 20mA, Diffused) - LG N971 [Digikey: 475-1407-6-ND] Red LED (15mcd, 20mA, Diffused) - LH N974 [Digikey: 475-1416-6-ND] Cree - Cree High-Power Surface Mount LEDs XPEBWT-L1-0000-00D50 - White 111lm 350mA 2.9Vf 6200K 110° XTEAWT-00-0000-00000LEE3 - White 114lm 350mA 2.85Vf 5000K 115° Everlight - Everlight 45-21 Series Surface Mount LEDs 45-21/QK2C-B2832AC2CB2/2T - Warm White 2000mcd 20mA 3.25Vf 3050K 120° 45-21/LK2C-B38452C4CB2/2T - Nuetral White 2000mcd 20mA 3.25Vf 4150K 120° 45-21/LK2C-B50634C6CB2/2T - Cold White 2200mcd 20mA 3.25Vf 5650K 120° PLCC2 Reverse Mount LS T77K-J1L2-1-0-2-R18-Z - Red 11.25mcd 2mA 1.8Vf 630nm 120° LO T77K-L1M2-24-Z - Orange 19.6mcd 2mA 1.8Vf 606nm 120° LY T77K-K2M1-26-Z - Yellow 15.7mcd 2mA 1.8Vf 587nm 120°; ROT: 270
L1 = microbuilder:INDUCTOR: Inductors 0603: 10nH Ceramic Inductor - microwire antenna/RF (Digikey: 712-1434-2-ND) 0805: 560nH Ceramic Inductor - RF (Digikey: 553-1047-1-ND) 270nH Ceramic Inductor - Q = 40@250MHz, +-5%, 1 Ohm DC Resistance (Digikey: 535-10506-2-ND) 1007 (2518 Metric) SMT: 10µH 10% 250mOhm 820mA 1007 Inductor (Digikey: 587-2189-1-ND) 22µH 10% 500mOhm 580mA 1007 Inductor (Digikey: 587-2190-1-ND) 47µH 10% 950mOhm 420mA 1007 Inductor (Digikey: 587-2191-1-ND) 47µH 5% 100mOhm 1A 1008 Inductor (Digikey: 732-1816-1-ND) 5.0x5.0mm (Taiyo Yuden NR5040 Series) 6.8µH 20% 2.3A 64mOhm Inductor (Digikey: 587-2374-2-ND) 5.0x5.0mm (TDK VLC5045 Series) 4.7µH 20% 3.3A 34mOhm Inductor (Digikey: 445-6526-1-ND) 6.8µH 20% 2.7A 46mOhm Inductor (Digikey: 445-6527-1-ND) 6.0x6.0mm (TDK VLC6045 Series) 4.7µH 20% 3.8A 27mOhm Inductor (Digikey: 445-6538-2-ND) 6.8µH 20% 3A 41mOhm Inductor (Digikey: 445-6540-1-ND) 6.2µH 30% 2.2A 45mOhm Inductor (Digikey: SRR5028-6R2YCT-ND) - Not TDK VLC6045 but footprint should match 6.0x6.0mm (TDK SLF6045 Series) 6.8uH 30% 2A 33mOhm Inductor (Digikey: 445-4572-1-ND, Mouser: 810-SLF645T6R8N2R0PF) 6.0x6.0mm (Sumida CDRH5D28 Series) 6.2uH 30% 1.8A 45mOhm Inductor (Digikey: 308-1542-1-ND) Taiyo Yuden NR3015T2R2M - 2.2uH 20% 1.5A (Digikey: 587-1648-2-ND, Mouser: 963-NR3015T2R2M) - Used with TI TPS62172 CoilCraft RFID Transponder Coil - MA5532-AE (For use with AS3935 Lightning Sensor) Taiyo Yuden NRH2412T2R2MNGH - 2.2uH 20% 1AA (Digikey: 587-3443-1-ND) - Used with TI LM3671 Vishay IHLP 1.0uH Molded Inductor - 24mOhm DCR, 5A, +/-20%, -55°C-125°C (Digikey: 541-1319-1-ND)
LED1-LED5 = microbuilder:WS2812B; ROT: 180
O1 = adafruit_sensor:GENERIC_IR_RECV
PTC1 = microbuilder:PTC: PTC (Resettable Fuse) 1206 Package 250mA PTC (16V Max, Time-to-Trip: 0.08s) - Digikey: F2110CT-ND 1210 Package 100mA PTC (30V Max, Time-to-Trip: 0.6s) - Digikey: MF-USMF010-2CT-ND 1812 Package 750mA PTC (24V Max, Time-to-Trip: 0.2s) - Digikey: MF-MSMF075/24-2CT-ND
Q1 = microbuilder:MOSFET-N: N-Channel Mosfet LEGEND VDS: Voltage Drain-Source ID: Drain Current RDS(ON): Drain-Source On-State Resistance VGS(TH): Gate-Source Threshold Voltage CISS: Drain-Source Input Capacitance SOT-23 Name VDS ID RDS(ON) VGS(TH) CISS Order Number 2N7002E 60V 260mA 2.5 Ohm 2.5V @ 250uA 26.7pF @ 25V 2N7002ET1GOSTR-ND BSH103 30V 850mA 400 mOhm 400mV @ 1mA 83pF @ 24V BSH103,235-ND BSS138 60V 320mA 1.6 Ohm 1.5V @ 250uA 50pF @ 10V Mouser: 771-BSS138PW115 DMN2075U-7 20V 4.2A 38 mOhm 1V @ 250 uA 594.3pF @ 10V DMN2075U-7DICT-ND * BSS138 good choice for I2C level-shifting POWERPAK 1212-8 Name VDS ID RDS(ON) VGS(TH) CISS Order Number Si7308DN 60V 6A 58 mOhm 3V @ 250uA 665pF @ 15V SI7308DN-T1-E3CT-ND
Q2 = microbuilder:MOSFET-N_DUAL: Dual N-Channel MOSFET SOT363 (2.0x1.25mm) 2N7002PS - 60V, 320mA [Digikey: 568-5984-1-ND]; JLC_ROTATION: 270
Q3 T1 = microbuilder:MOSFET-P: P-Channel Mosfet LEGEND VDS: Voltage Drain-Source ID: Drain Current RDS(ON): Drain-Source On-State Resistance VGS(TH): Gate-Source Threshold Voltage CISS: Drain-Source Input Capacitance SOT-23 Name VDS ID RDS(ON) VGS(TH) CISS Order Number IRLML5103 30V 760mA 600 mOhm -- 75pF @ 25V Digikey: IRLML5103PBFCT-ND IRLML6401 12V 4.3A 50 mOhm 950mV @ 250µA 830pF @ 10V Digikey: IRLML6401PBFTR-ND NTR0202PL 20V 400mA 800 mOhm 2.3V @ 250uA 70pF @ 5V Digikey: NTR0202PLT1GOSTR-ND NTR4101PT1G 20V 1.8A 85 mOhm 1.2V @ 250uA 675pF @ 10V Digikey: NTR4101PT1GOSCT-ND DMP2004K 20V 600mA 900 mOhm 1V @ 250uA 175pF @ 16V Digikey: DMP2004KDICT-ND PMV65XP 20V 3.9A 76 mOhm 950mV @ 1mA 725pF @ 20V Digikey: 568-2358-2-ND TO-252 Name VDS ID RDS(ON) VGS(TH) CISS Order Number AOD417 30V 25A 34 mOhm 3V @ 250µA 920pF @ 15V Digikey: 785-1106-2-ND PowerPak Name VDS ID RDS(ON) VGS(TH) CISS Order Number AON7401 30V 12A 14 mOhm 3V @ 250µA 2600pF @ 15V Digikey: 785-1302-1-ND
R1-R11 R13 R16-R28 R32 R38 = microbuilder:RESISTOR: Resistors For new designs, use the packages preceded by an '_' character since they are more reliable: The following footprints should be used on most boards: _0402 - Standard footprint for regular board layouts _0603 - Standard footprint for regular board layouts _0805 - Standard footprint for regular board layouts _1206 - Standard footprint for regular board layouts For extremely tight-pitch boards where space is at a premium, the following 'micro-pitch' footprints can be used (smaller pads, no silkscreen outline, etc.): _0402MP - Micro-pitch footprint for very dense/compact boards _0603MP - Micro-pitch footprint for very dense/compact boards _0805MP - Micro-pitch footprint for very dense/compact boards _1206MP - Micro-pitch footprint for very dense/compact boards
R12 R14 R15 = microbuilder:RESISTOR_4PACK: Resistor Packs (4 resistors) 4 x 0603 10K 1/16W - Digikey: YC164J-10KCT-ND
SENSE1 = adafruit_electromech:CON_JST_PH_3PIN
SJ1 = microbuilder:SOLDERJUMPER_2WAY: 2-Way Solder Jumper
SW2 = adafruit_electromech:SWITCH_SPDT: Switch - SPDT SSSS811101 - Horizontal Two Position SMT, 0.3A 4V [Mouser: 688-SSSS811101]
TP1 = microbuilder:TESTPOINT: Test Point Various test points for characterisation and PCB testing TESTPOINT_SMT - Compact Surface Mount Test Point [Digikey: 5016KTR-ND]
TP2-TP5 = adafruit_electromech:SEWTAP; FORCETHM: 1
U2 = SmartPrj:LP2985-XXDBVR: ULTRALOW-POWER 50-mA LOW-DROPOUT LINEAR REGULATORS 50-mA Low-Dropout Regulator Source: http://focus.ti.com/lit/ds/symlink/tps77001.pdf
U3 U6 = microbuilder:SPIFLASH_8PIN: SOIC8 SPI Flash Be careful with the size since SOIC8 flash comes in several 'widths' SOIC8 150 mil M25P16 - 16Mbit (2Mbit x 8) Serial Flash (75MHz SPI Bus), Supply: 2.7-3.6V Digikey: SOIC8 - M25P16-VMN6P-ND SOIC8 208 mil W25Q16BVSSIG - 16Mbit (2Mbit x 8) Serial Flash (104MHz SPI Bus), Supply: 2.7-3.6V Digikey: SOIC8 - W25Q16BVSSIG-ND
U4 = microbuilder:TLV320DAC3100
U5 = adafruit_power:VREG_SOT23-5: SOT23-5 Fixed Voltage Regulators Part Current Out V Out V In V Dropout θJA (°C/W) TJ (°C) Digikey Part No. ADP121 150mA 3.3V 3.4-5.5V 0.09V @ 150mA -- -- ADP121-AUJZ33R7CT-ND ADP121 150mA 3.0V 3.1-5.5V 0.09V @ 150mA -- -- ADP121-AUJZ30R7CT-ND ADP122 300mA 3.3V 3.4-5.5V 0.085V @ 300mA -- -- ADP122AUJZ-3.3-R7CT-ND ADP1712 300mA 3.3V 3.5-5.5V 0.17V @ 300mA -- -- ADP1712AUJZ-3.3-R7TR-ND AP7311 (Low Cost) 150mA 3.3V 3.5-6V 0.15V @ 150mA -- -- AP7311-33WG-7DICT-ND LD39015M18R 150mA 1.8V 1.9V-5.5V 0.08V @ 100mA -- -- 497-6977-1-ND LP2985A-33DBVR 150mA 3.3V 3.3-16V 0.28V @ 150mA 206 150 296-18479-1-ND MCP1824T-3302E/OT 300mA 3.3V 3.5V-6V 0.2V @ 300mA -- -- MCP1824T-3302E/OTCT-ND MIC5205-2.5YM5 TR 150mA 2.5V 2.7-16V 0.165V @ 150mA -- -- 576-1257-2-ND MIC5205-3.0YM5 TR 150mA 3.0V 3.2V-16V 0.165V @ 150mA -- -- 576-1258-2-ND MIC5205-3.3YM5 TR 150mA 3.3V 3.5V-16V 0.165V @ 150mA -- -- 576-1259-2-ND TPS780330220 150mA 3.3V+2.2V 3.6-5.5V 250mV Max -- -- 296-23332-1-ND TDA3663/N1,135 100mA 3.3V 3.5-45V 0.18V @ 50mA -- -- 568-5343-1-ND Max operating temp can be calculated using θJA, TJ (max junction temperature), and power in watts. Set the "Maximum Ambient Temperature" until it reaches TJ ("Max Junction Temperature"), which is the absolute limit for safe use of the regulator: Heat Sink Temperature Calculator <http://www.daycounter.com/Calculators/Heat-Sink-Temperature-Calculator.phtml> For example, With 12V source into a 3.3V LP2985 and a 30mA load, we are dissipating (12V-3.3V) * 0.03A = 0.261W. With a θJA of 206 °C/W, a TJ of 150°C, and 261mW we can safely use the chip without a heat sink up to 75°C (=147.1°C Junction Temperature).; JLC_ROTATION: 270
U9 = adafruit_wireless:ESP32-C6-MINI
X1 = adafruit_electromech:MICROSD: MicroSD/Transflash Card Holder with SPI pinout 3M: 2908-05WB-MG 4UConnector: 19656 Footprint courtesy: Adafruit Industries; JLC_ROTATION: 90; LCSC: C125617
X2 X5 = adafruit_electromech:USB_TYPEA: USB - Type A Connectors Male types stick out and are inserted into a PC or matching females parts (these are the connectors used on USB Memory Sticks, etc.). Female parts are generally used for USB Host and accept a male-type connector. SMT - 4UCON: 10017 PTHFML - Digikey: 609-1045-ND, 4UCon: 05241 PCB - Use 2.0mm thick PCBs with this footprint
X3 = adafruit_electromech:USB_C: USB Type-C USB 2.0 Connector; LCSC: C165948
X4 = adafruit_micro:RP2350B
X6 = adafruit_micro:CH334F
X7 = adafruit_electromech:HDMI_MOLEX_47151: The default footprint uses layer 46 (Milling) for the tabs, the DIMLAYER footprint uses layer 20 (Dimensions). Both will probably require special instructions to the board house; LCSC: C138388
X8 = adafruit_electromech:TRRS_2SWITCH
X9 = adafruit_electromech:CON_MOLEX_2P
Y1 Y2 = microbuilder:CRYSTAL: Crystals HC49UP - Surface Mount Crystal 4.0MHz 18pF +/-30ppm Surface Mount Crystal [Digikey: 535-9857-1-ND] 12.0 MHz Surface Mount Crystal [Digikey: 535-9869-6-ND] 25.0 MHz Surface Mount Crystal [Digikey: 535-9078-1-ND] 2.5 x 2.0mm - MEMs SMT Crystal 16.0 MHz 10pF 20ppm 2.5 x 2.0mm Crystal [Digikey -40-85°C: 535-10923-1-ND] 3.2 x 2.5mm - MEMs SMT Crystal 12.0 MHz 8pF 15ppm 3.2 x 2.5mm Crystal [Digikey: -10-70°C: 644-1047-1-ND -40-125°C: 644-1128-1-ND] 40~85°C cheaper: 644-1173-6-ND 16.0 MHz 8pF 15ppm 3.2 x 2.5mm Crystal [Digikey: -10-70°C: 644-1049-1-ND -40-125°C: 644-1129-2-ND]-40~85°C cheaper: 644-1175-6-ND 16.0 MHz 10pF 10ppm 3.2 x 2.5mm Crystal [Digikey: 644-1100-1-ND] 27.12 MHz 18pF 30ppm 3.2 x 2.5mm Crystal [Digikey: 887-1424-1-ND] 27.12MHz 10pF 10ppm 3.2 x 2.5mm Crystal [Digikey: 887-1329-1-ND] 4.9 x 1.8mm - MEMs SMT Crystal 32.768 KHz 12.5pF 20ppm 4.9 x 1.8mm Crystal [Digikey: SE2415CT-ND] 8.0 x 3.8mm - Surface Mount Crystal 32.768kHz 12.5pF 20ppm -40°C-85°C [Digikey: 535-9166-2-ND] Cylinder 32.768KHz Cylinder Crystal (2x6mm body) [Ex. Digikey: 300-8341-2-ND]

## Net classes
3 Power: width 0.305 mm, drill 0.483 mm
4 LOWPOWER: width 0.254 mm